# EAGLE design untitled (EAGLE 9.2.2)
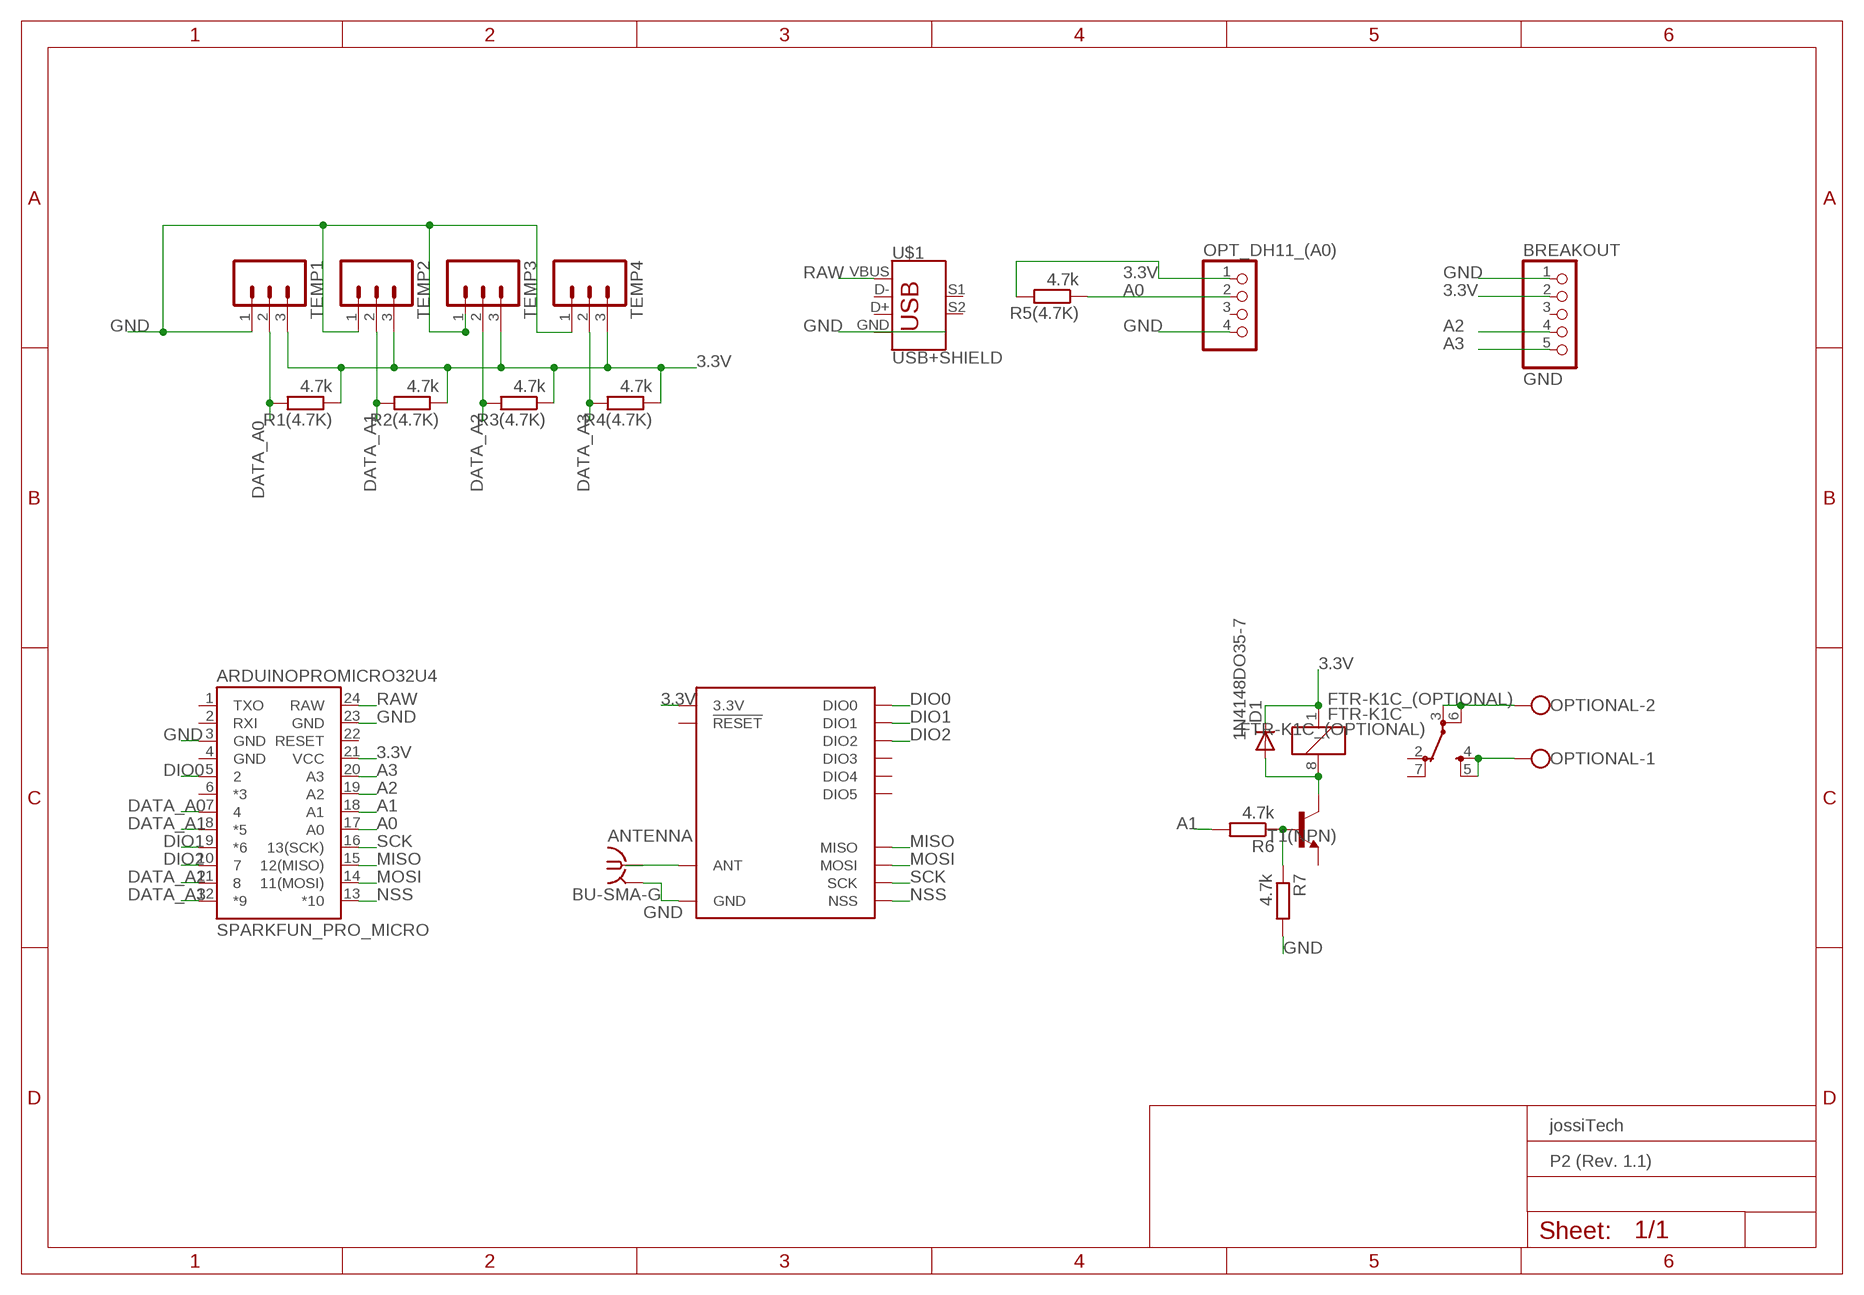
[diagram p0: schematic, sheet 1]
FRAME1 (A4L-LOC): COMPANY: jossiTech; PRODUCT: P2 (Rev. 1.1)

## Parts
ANTENNA  BU-SMA-G  [BU-SMA-G]
ARDUINOPROMICRO32U4  SPARKFUN_PRO_MICRO  [SPARKFUN_PRO_MICRO]
BREAKOUT  GND  PINHD-1X5  [1X05]
D1  1N4148DO35-7  [DO35-7]
FTR-K1C_(OPTIONAL)  FTR-K1C  [FTR-K1C]
OPT_DH11_(A0)  PINHD-1X4  [1X04]
OPTIONAL  W237-102  [W237-102]
R1(4.7K)  4.7k  R0207/10  [0207/10]
R2(4.7K)  4.7k  R0207/10  [0207/10]
R3(4.7K)  4.7k  R0207/10  [0207/10]
R4(4.7K)  4.7k  R0207/10  [0207/10]
R5(4.7K)  4.7k  R0207/10  [0207/10]
R6  4.7k  R0207/10  [0207/10]
R7  4.7k  R0207/10  [0207/10]
T1(NPN)  BC237-NPN-TO92-CBE  [TO92-CBE]
TEMP1  M03  [03P]
TEMP2  M03  [03P]
TEMP3  M03  [03P]
TEMP4  M03  [03P]
U2  RFM95W  [RFM95/96/97/98W]
U$1  USB+SHIELD  [USB-B-PTH]

## Nets
3.3V: ARDUINOPROMICRO32U4.21(VCC) BREAKOUT.2 D1.C FTR-K1C_(OPTIONAL).1 OPT_DH11_(A0).1 R1(4.7K).1 R2(4.7K).1 R3(4.7K).1 R4(4.7K).1 R5(4.7K).2 TEMP1.3 TEMP2.3 TEMP3.3 TEMP4.3 U2.3.3V
A0: ARDUINOPROMICRO32U4.17(A0) OPT_DH11_(A0).2 R5(4.7K).1
A1: ARDUINOPROMICRO32U4.18(A1) R6.2
A2: ARDUINOPROMICRO32U4.19(A2) BREAKOUT.4
A3: ARDUINOPROMICRO32U4.20(A3) BREAKOUT.5
DATA_A0: ARDUINOPROMICRO32U4.7 R1(4.7K).2 TEMP1.2
DATA_A1: ARDUINOPROMICRO32U4.8(*5) R2(4.7K).2 TEMP2.2
DATA_A2: ARDUINOPROMICRO32U4.11 R3(4.7K).2 TEMP3.2
DATA_A3: ARDUINOPROMICRO32U4.12(*9) R4(4.7K).2 TEMP4.2
DIO0: ARDUINOPROMICRO32U4.5 U2.DIO0
DIO1: ARDUINOPROMICRO32U4.9(*6) U2.DIO1
DIO2: ARDUINOPROMICRO32U4.10 U2.DIO2
GND: ANTENNA.2 ANTENNA.3 ANTENNA.4 ANTENNA.5 ARDUINOPROMICRO32U4.3(GND) ARDUINOPROMICRO32U4.23(GND) BREAKOUT.1 OPT_DH11_(A0).4 R7.2 TEMP1.1 TEMP2.1 TEMP3.1 TEMP4.1 U2.GND@1(GND) U2.GND@2(GND) U2.GND@3(GND) U$1.GND
MISO: ARDUINOPROMICRO32U4.15(12(MISO)) U2.MISO
MOSI: ARDUINOPROMICRO32U4.14(11(MOSI)) U2.MOSI
N$1: ANTENNA.1 U2.ANT
N$2: D1.A FTR-K1C_(OPTIONAL).8 T1(NPN).C
N$3: R6.1 R7.1 T1(NPN).B
N$5: FTR-K1C_(OPTIONAL).4(-1:SA) FTR-K1C_(OPTIONAL).5(-1:SB) OPTIONAL.1
N$6: FTR-K1C_(OPTIONAL).3(-1:PA) FTR-K1C_(OPTIONAL).6(-1:PB) OPTIONAL.2
NSS: ARDUINOPROMICRO32U4.13(*10) U2.NSS
RAW: ARDUINOPROMICRO32U4.24(RAW) U$1.VBUS
SCK: ARDUINOPROMICRO32U4.16(13(SCK)) U2.SCK
Unconnected: ARDUINOPROMICRO32U4.1(TXO) ARDUINOPROMICRO32U4.2(RXI) ARDUINOPROMICRO32U4.6(*3) ARDUINOPROMICRO32U4.22(RESET) BREAKOUT.3 FTR-K1C_(OPTIONAL).2(-1:OA) FTR-K1C_(OPTIONAL).7(-1:OB) OPT_DH11_(A0).3 T1(NPN).E U2.!RESET U2.DIO3 U2.DIO4 U2.DIO5 U$1.D+ U$1.D- U$1.S1 U$1.S2

## Power pins joined to a net without a drawn wire
GND: ARDUINOPROMICRO32U4.4(GND)

## Library data of the parts
ANTENNA = con-coax:BU-SMA-G: FEMALE SMA CONNECTOR Radiall distributor RS 193-9117; OC_FARNELL: unknown; OC_NEWARK: unknown
ARDUINOPROMICRO32U4 = SparkFun-Boards:SPARKFUN_PRO_MICRO: SparkFun Pro Micro Atmega32U4 compatible footprint. SparkFun Products: 3.3V/8MHz <https://www.sparkfun.com/products/12587> 5V/16MHz <https://www.sparkfun.com/products/12640>
BREAKOUT = pinhead:PINHD-1X5: PIN HEADER
D1 = diode:1N4148: DIODE high speed (Philips)
FTR-K1C_(OPTIONAL) = relay:FTR-K1C: NETZRELAIS FTR-K1CK024W1XUM 16A/250VAC 1 Umschaltkontakt Distributor: Conrad Electronic Bestell Nr.: 504389-13 - 24V Source: http://www.produktinfo.conrad.com/datenblaetter/500000-524999/504384-da-01-de-NETZRELAIS_FTR_K1CK012W1XUM_16A_250VAC.pdf; OC_FARNELL: unknown; OC_NEWARK: unknown
OPT_DH11_(A0) = pinhead:PINHD-1X4: PIN HEADER
OPTIONAL = con-wago-500:W237-102: WAGO SCREW CLAMP; MPN: 237-102; OC_FARNELL: unknown; OC_NEWARK: 70K9898
R1(4.7K) R2(4.7K) R3(4.7K) R4(4.7K) R5(4.7K) R6 R7 = eagle-ltspice:R: RESISTOR, European symbol; SPICEMODEL: NONE; SPICEPREFIX: R
T1(NPN) = transistor:*-NPN-: NPN Transistror BF959 corrected 2008.03.06
TEMP1-TEMP4 = con-amp-quick:M03: AMP QUICK CONNECTOR; OC_FARNELL: unknown; OC_NEWARK: unknown
U2 = SparkFun-RF:RFM95W: RFM95/96/97/98 The RFM95/96/97/98(W) transceivers feature the LoRaTM long range modem that provides ultra-long range spread spectrum communication and high interference immunity whilst minimising current consumption. These devices also support high performance (G)FSK modes for systems including WMBus, IEEE802.15.4g. The RFM95/96/97/98(W) deliver exceptional phase noise, selectivity, receiver linearity and IIP3 for significantly lower current consumption than competing devices Datasheet <http://www.hoperf.com/upload/rf/RFM95_96_97_98W.pdf>; PROD_ID: IC-13959
U$1 = SparkFun-Retired:USB+SHIELD: USB+Shield USB connector with shield pins connectable

## Board
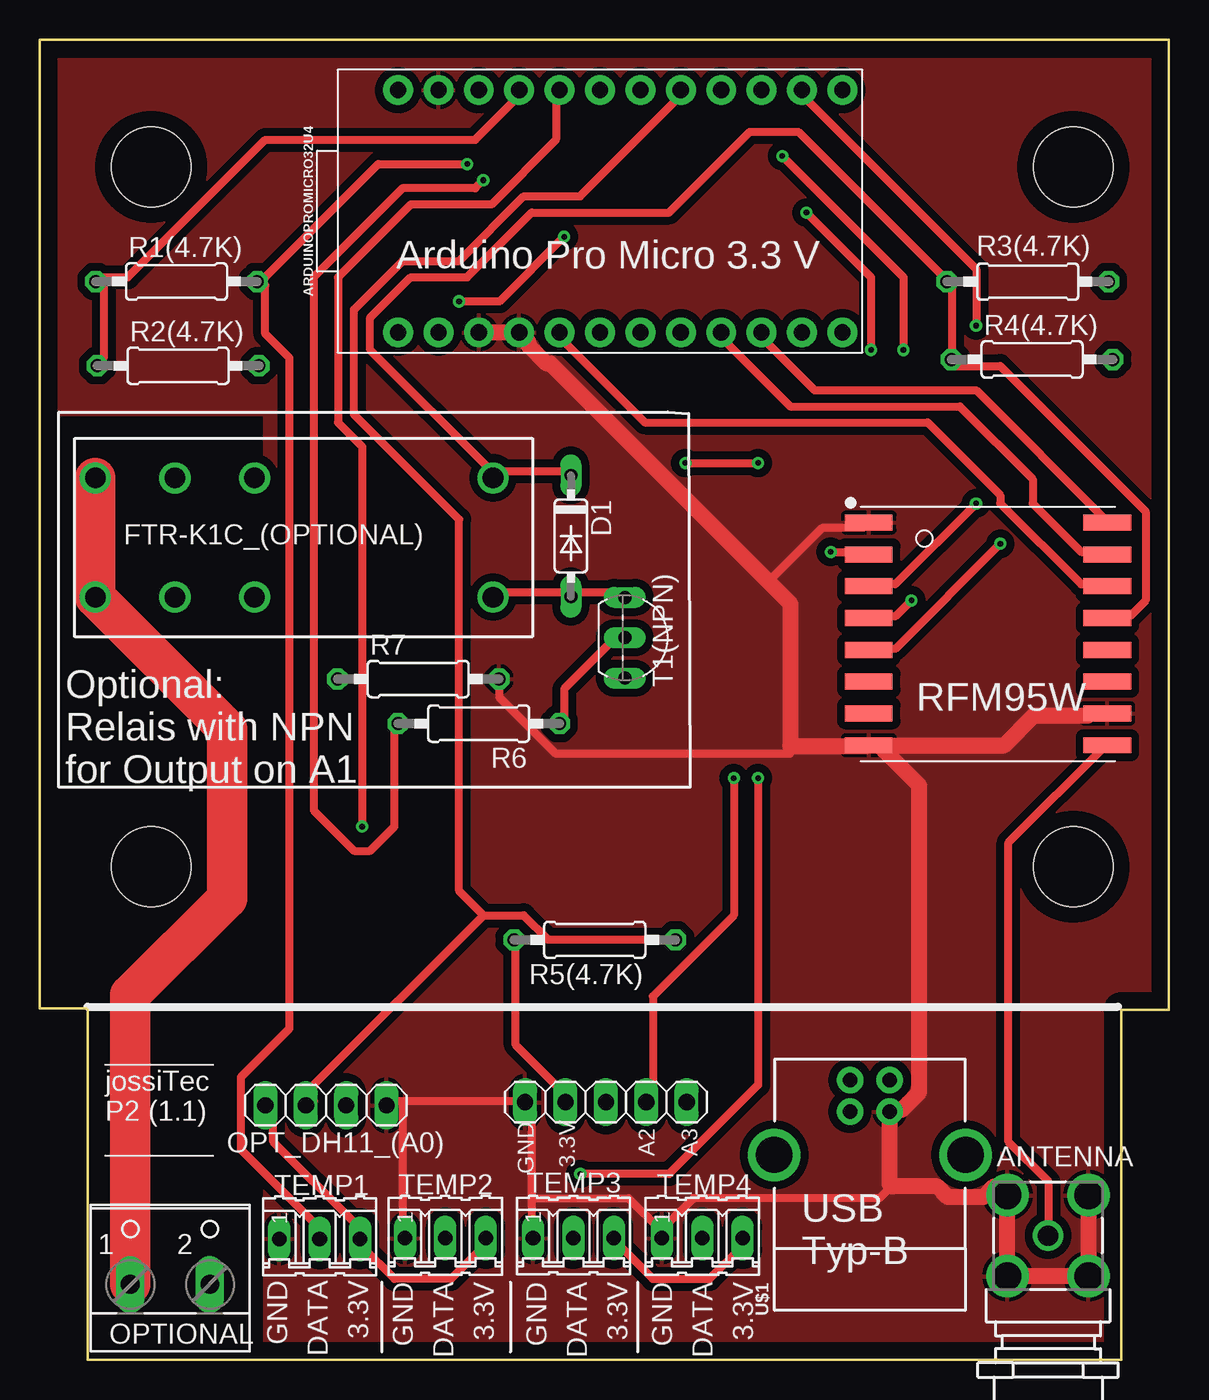
[diagram p1: board, top side]
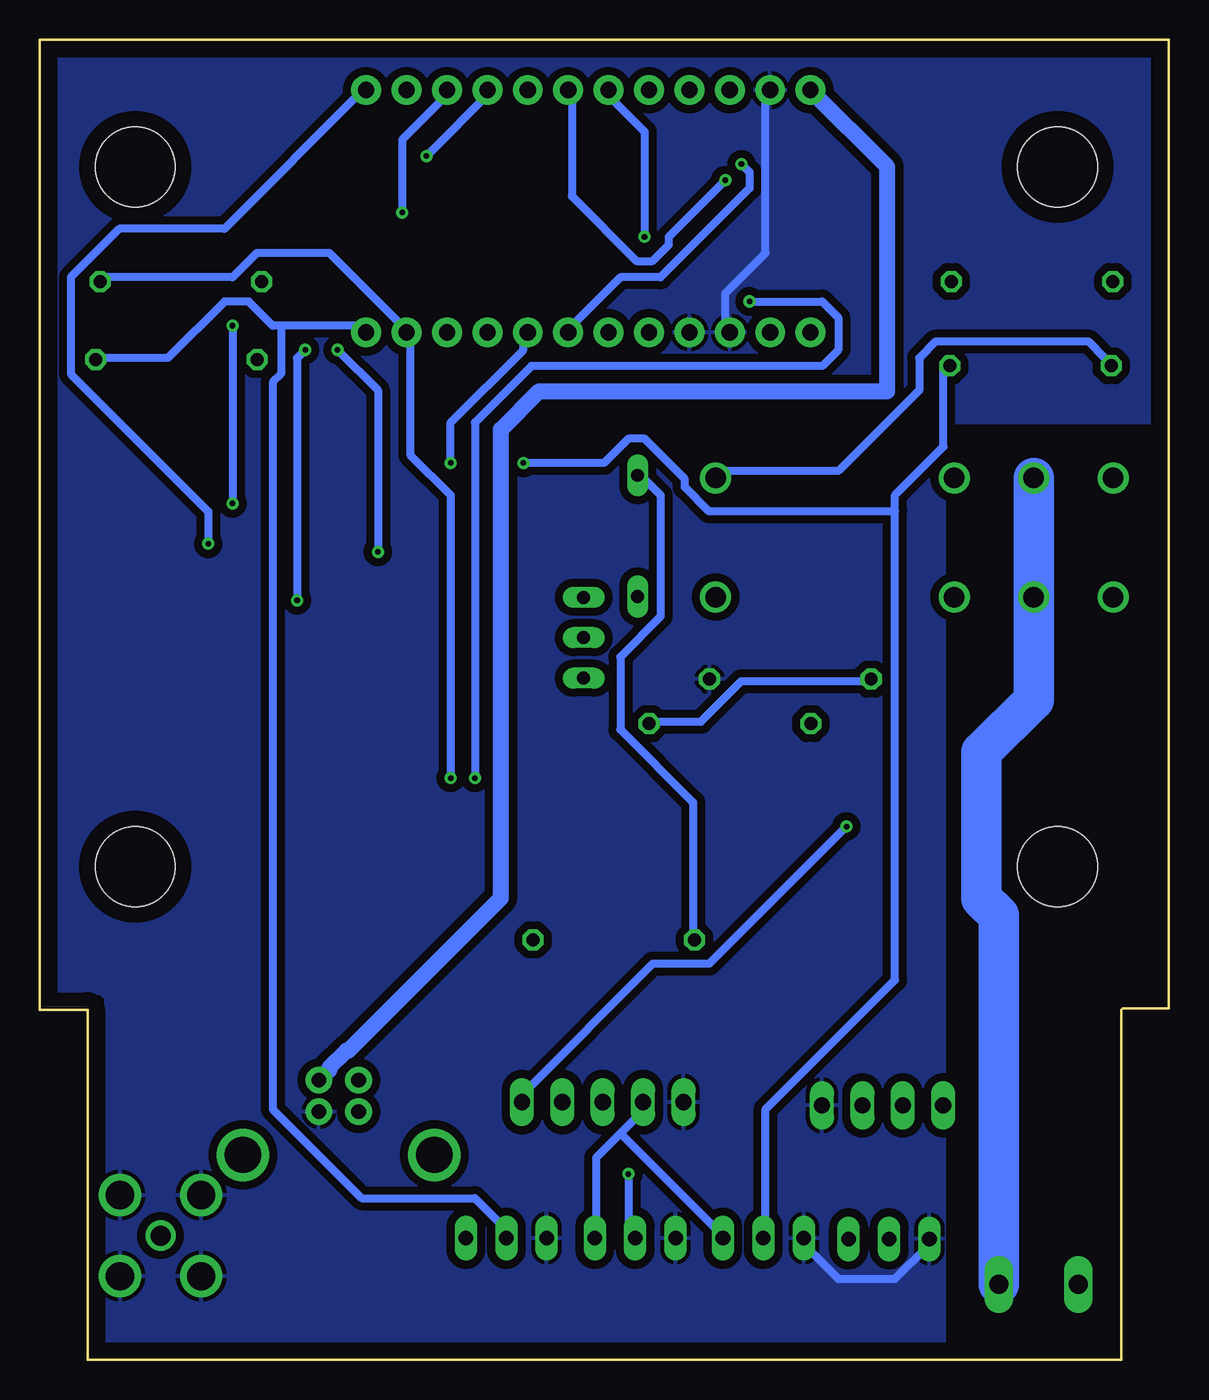
[diagram p2: board, bottom side, seen from below]

Size 71 x 83 mm. Coordinates in mm from the lower left corner, seen from the top.
Outline: 3,0 3,22 2.9,22.1 0,22.1 0,83 71,83 71,22 68,22 68,0 3,0
Copper layers (1*16): Top 0.035mm / dielectric 1.5mm / Bottom 0.035mm
Design rules "default *": minimum track width 20mil, minimum drill 0.35mm, track to track 20mil, track to pad 20mil, pad to pad 20mil, via to via 20mil, smd to smd 20mil, copper to edge 40mil, drill to drill 20mil, minimum pad ring 10mil, minimum via ring 8mil, stop-mask expansion 4mil, vias tented up to drill 0mil, thermal gap 10mil
Holes 5 mm at 7,31 65,31 7,75 65,75
tRestrict: area -2,0.6 to 14,59.3
bRestrict: area -1.2,1.1 to 14,58.8

### Footprints (pad centres in the part's own frame; a part is rotated, then mirrored left to right if it is on the bottom)
BU-SMA-G = drill 1.27: 1 0,0 | drill 1.778: 2 -2.55,2.55; 3 2.55,2.55; 4 2.55,-2.55; 5 -2.55,-2.55
SPARKFUN_PRO_MICRO = drill 1.016 pad 1.88: 1 -7.62,12.7; 2 -7.62,10.16; 3 -7.62,7.62; 4 -7.62,5.08; 5 -7.62,2.54; 6 -7.62,0; 7 -7.62,-2.54; 8 -7.62,-5.08; 9 -7.62,-7.62; 10 -7.62,-10.16; 11 -7.62,-12.7; 12 -7.62,-15.24; 13 7.62,-15.24; 14 7.62,-12.7; 15 7.62,-10.16; 16 7.62,-7.62; 17 7.62,-5.08; 18 7.62,-2.54; 19 7.62,0; 20 7.62,2.54; 21 7.62,5.08; 22 7.62,7.62; 23 7.62,10.16; 24 7.62,12.7
1X05 = drill 1.016 long: 1 -5.08,0; 2 -2.54,0; 3 0,0; 4 2.54,0; 5 5.08,0
DO35-7 = drill 0.813 long: A 3.81,0; C -3.81,0
FTR-K1C = drill 1.3 pad 1.93: 1 -12.5,-3.75; 2 2.5,-3.75; 3 7.5,-3.75; 4 12.5,-3.75; 5 12.5,3.75; 6 7.5,3.75; 7 2.5,3.75; 8 -12.5,3.75
1X04 = drill 1.016 long: 1 -3.81,0; 2 -1.27,0; 3 1.27,0; 4 3.81,0
W237-102 = drill 1.194 long: 1 -2.5,-1.27; 2 2.5,-1.27
0207/10 = drill 0.813 octagon: 1 -5.08,0; 2 5.08,0
TO92-CBE = drill 0.813 long: B 0,0; C -2.54,0; E 2.54,0
03P = drill 0.914 long: 1 -2.54,0; 2 0,0; 3 2.54,0
RFM95/96/97/98W = smd 3 x 1: 3.3V 7.5,1; !RESET -7.5,-3; ANT 7.5,-7; DIO0 7.5,3; DIO1 7.5,5; DIO2 7.5,7; DIO3 7.5,-3; DIO4 7.5,-1; DIO5 -7.5,-5; GND@1 -7.5,7; GND@2 -7.5,-7; GND@3 7.5,-5; MISO -7.5,5; MOSI -7.5,3; NSS -7.5,-1; SCK -7.5,1
USB-B-PTH = drill 0.914 pad 1.676: D+ 0,1.25; D- 1.981,1.25; GND 0,-1.25; VBUS 1.981,-1.25 | drill 2.286: S1 -2.718,-6.02; S2 -2.718,6.02

### Placement (x,y rotation side)
ANTENNA  63.4,7.8 270 top
ARDUINOPROMICRO32U4  35.23,72.22 90 top
BREAKOUT  35.6,16.2 0 top
D1  33.4,51.8 270 top
FTR-K1C_(OPTIONAL)  16,51.7 180 top
OPT_DH11_(A0)  18,16 0 top
OPTIONAL  8.2,6 0 top
R1(4.7K)  8.6,67.8 0 top
R2(4.7K)  8.7,62.5 0 top
R3(4.7K)  62.13,67.79 0 top
R4(4.7K)  62.4,62.9 0 top
R5(4.7K)  34.9,26.4 180 top
R6  27.6,40 180 top
R7  23.8,42.8 0 top
T1(NPN)  36.8,45.4 270 top
TEMP1  17.6,7.6 0 top
TEMP2  25.5,7.64 0 top
TEMP3  33.56,7.65 0 top
TEMP4  41.66,7.64 0 top
U2  59.63,45.64 0 top
U$1  52.2,15.6 90 top

### Tracks (layer width: path | path; a pad name or v marks a point on that pad's centre or on a via)
3.3V
  Top 0.508: TEMP2.3 28.4,7.62 25.86,5.08 22.3,5.08 20.27,7.11 TEMP1.3 19.76,7.62 19.76,8.64 14.68,13.72 14.68,15.75 OPT_DH11_(A0).1 | R5(4.7K).2 29.92,25.91 29.92,19.81 33.48,16.26 BREAKOUT.2 | TEMP4.3 44.15,7.62 44.15,7.11 42.12,5.08 38.56,5.08 36.02,7.62 TEMP3.3 | U2.3.3V 67.52,46.74 68.53,46.74 69.55,47.75 69.55,53.34 60.4,62.48 57.36,62.48 R4(4.7K).1 57.36,62.99 57.36,67.56 R3(4.7K).1 56.85,68.07 47.7,77.22 44.66,77.22 39.58,72.14 30.94,72.14 26.88,68.07 23.32,68.07 20.78,65.53 20.78,63.5 28.4,55.88 FTR-K1C_(OPTIONAL).1 28.91,55.88 32.97,55.88 D1.C | R2(4.7K).1 4.02,62.99 4.02,67.56 R1(4.7K).1 4.02,68.07 5.54,68.07 14.18,76.71 27.38,76.71 29.92,79.25 29.92,79.76 ARDUINOPROMICRO32U4.21
  Bottom 0.508: 34.5,14.22 32.97,15.75 BREAKOUT.2 | 34.5,14.22 36.02,12.7 36.02,8.13 TEMP3.3 | 34.5,14.22 28.4,8.13 TEMP2.3 | FTR-K1C_(OPTIONAL).1 28.4,55.88 20.78,55.88 15.7,60.96 15.7,62.99 14.68,64.01 5.03,64.01 4.02,62.99 R2(4.7K).1 | R5(4.7K).2 29.92,26.42 29.92,35.05 34.5,39.62 34.5,44.2 31.96,46.74 31.96,54.36 32.97,55.37 D1.C
A0
  Top 0.508: 27.89,27.94 30.43,27.94 31.96,26.42 39.58,26.42 R5(4.7K).1 | 27.89,27.94 17.22,17.27 17.22,16.26 OPT_DH11_(A0).2 | 27.89,27.94 26.37,29.46 26.37,52.83 19.76,59.44 19.76,66.04 22.81,69.09 26.37,69.09 30.43,73.15 33.99,73.15 40.08,79.25 40.08,79.76 ARDUINOPROMICRO32U4.17
A1  (via drill 0.35)
  Top 0.508: v27.89,74.17 27.38,73.66 22.81,73.66 17.22,68.07 17.22,34.54 19.76,32 20.78,32 22.3,33.53 22.3,39.62 R6.2
  Bottom 0.508: v27.89,74.17 31.45,70.61 31.45,70.1 32.46,69.09 33.48,69.09 37.54,73.15 37.54,79.76 ARDUINOPROMICRO32U4.18
A2  (via drill 0.35)
  Top 0.508: v43.64,36.58 43.64,27.94 38.56,22.86 38.56,16.26 BREAKOUT.4 | v26.37,66.55 28.91,66.55 v32.97,70.61
  Bottom 0.508: v43.64,36.58 43.64,58.93 40.08,62.48 21.8,62.48 20.78,63.5 20.78,65.53 21.8,66.55 v26.37,66.55 | v32.97,70.61 32.97,77.22 35.51,79.76 ARDUINOPROMICRO32U4.19
A3  (via drill 0.35)
  Top 0.508: v20.27,33.53 20.27,57.4 18.75,58.93 18.75,68.07 23.32,72.64 28.4,72.64 32.46,76.71 32.46,79.76 ARDUINOPROMICRO32U4.20
  Bottom 0.508: v20.27,33.53 28.91,24.89 32.46,24.89 40.59,16.76 40.59,16.26 BREAKOUT.5
DATA_A0  (via drill 0.35)
  Top 0.508: TEMP1.2 17.22,7.62 17.22,8.64 12.65,13.21 12.65,17.78 15.7,20.83 15.7,62.99 14.18,64.52 14.18,67.56 R1(4.7K).2 14.18,68.07 21.29,75.18 v26.88,75.18
  Bottom 0.508: v26.88,75.18 26.37,74.68 26.37,73.66 31.96,68.07 34.5,68.07 37.54,65.02 ARDUINOPROMICRO32U4.7
DATA_A1  (via drill 0.35)
  Top 0.508: v40.59,56.39 v45.16,56.39
  Bottom 0.508: 17.22,53.34 17.22,23.88 25.35,15.75 25.35,8.13 TEMP2.2 | 17.22,53.34 17.22,54.36 14.18,57.4 14.18,62.48 R2(4.7K).2 | v45.16,56.39 45.16,58.93 40.59,63.5 40.59,64.52 ARDUINOPROMICRO32U4.8 | v40.59,56.39 35.51,56.39 33.99,57.91 32.97,57.91 30.43,55.37 30.43,54.86 28.91,53.34 17.22,53.34
DATA_A2  (via drill 0.35)
  Top 0.508: v33.99,11.68 39.58,11.68 45.16,17.27 v45.16,36.58
  Bottom 0.508: R3(4.7K).2 67.01,68.07 58.88,68.07 57.36,69.6 52.78,69.6 48.21,65.02 ARDUINOPROMICRO32U4.11 47.7,64.52 47.7,56.9 45.16,54.36 v45.16,36.58 | v33.99,11.68 33.99,8.13 TEMP3.2
DATA_A3
  Bottom 0.508: 55.83,65.02 50.75,65.02 ARDUINOPROMICRO32U4.12 | 55.83,65.02 56.34,65.02 57.86,66.55 59.39,66.55 62.94,62.99 67.01,62.99 R4(4.7K).2 | 55.83,65.02 55.83,61.98 56.34,61.47 56.34,15.75 50.75,10.16 43.64,10.16 42.12,8.64 42.12,8.13 TEMP4.2
DIO0
  Top 0.508: U2.DIO0 67.01,48.77 65.48,48.77 60.4,53.85 60.4,54.36 55.83,58.93 38.05,58.93 32.46,64.52 ARDUINOPROMICRO32U4.5
DIO1
  Top 0.508: U2.DIO1 67.01,50.8 65.48,50.8 62.44,53.85 62.44,55.37 57.86,59.94 47.2,59.94 42.62,64.52 ARDUINOPROMICRO32U4.9
DIO2
  Top 0.508: U2.DIO2 67.01,52.83 58.88,60.96 48.72,60.96 45.16,64.52 ARDUINOPROMICRO32U4.10
GND
  Top 0.508: 30.94,10.16 30.94,15.75 BREAKOUT.1 30.43,16.26 22.81,16.26 | 30.94,10.16 30.94,8.13 TEMP3.1 | 30.94,10.16 37.04,10.16 39.07,8.13 TEMP4.1 39.58,8.13 39.58,8.64 41.1,10.16 52.78,10.16 53.29,10.67 53.45,11.05 | 22.81,16.26 22.3,16.26 OPT_DH11_(A0).4 | 22.81,16.26 22.81,8.13 TEMP2.1 | R7.2 28.91,42.67 28.91,41.66 32.46,38.1 47.2,38.1 47.2,38.6 | 45.83,48.92 49.23,52.32 51.77,52.32 U2.GND@1 | U2.GND@3 65.99,40.64 65.9,40.5 | 53.1,38.3 53.29,38.61 U2.GND@2
  Top 1.016: ANTENNA.2 ANTENNA.3 ANTENNA.4 ANTENNA.5 60.3,10.9 60.01,10.9 59.33,10.21 57.12,10.21 56.43,10.9 53.6,10.9 53.45,11.05 U$1.GND 53.58,15.73 54.22,15.73 55.3,16.81 55.3,36.1 53.1,38.3 | 65.9,40.5 62.5,40.5 60.64,38.64 U2.GND@2 52.09,38.6 47.2,38.6 47.2,47.55 45.83,48.92 32.11,62.64 31.88,62.64 30.73,63.79 30.73,64.02 ARDUINOPROMICRO32U4.4 ARDUINOPROMICRO32U4.3
  Bottom 0.508: TEMP1.1 15.19,7.11 17.22,5.08 20.78,5.08 23.32,7.62 TEMP2.1 | ARDUINOPROMICRO32U4.23 25.35,79.76 25.35,69.6 27.89,67.06 27.89,65.02 ARDUINOPROMICRO32U4.3
  pour Top: 0.5,82.3 0.5,22.7 3.6,22.7 3.6,1.2 4,0.8 67,0.8 67.6,0.2 67.6,22.5 67.5,22.6 70.3,22.6 70.5,22.8 70.5,82.2 70.2,82.5 0.5,82.5
  pour Bottom: 0.7,82.5 0.7,22.7 3.6,22.7 3.6,0.6 66.9,0.6 66.9,22.7 67.1,22.9 67.2,23 70.5,23 70.5,82.4 70.6,82.5
MISO  (via drill 0.35)
  Top 0.508: v49.74,50.8 51.77,50.8 U2.MISO | v52.28,63.5 52.28,68.07 v48.21,72.14
  Bottom 0.508: v49.74,50.8 49.74,60.96 v52.28,63.5 | v48.21,72.14 48.21,76.71 45.16,79.76 ARDUINOPROMICRO32U4.15
MOSI  (via drill 0.35)
  Top 0.508: v58.88,53.85 53.8,48.77 52.28,48.77 U2.MOSI | v58.88,65.02 58.88,68.58 47.7,79.76 ARDUINOPROMICRO32U4.14
  Bottom 0.508: v58.88,65.02 v58.88,53.85
N$1
  Top 0.508: U2.ANT 67.01,38.61 60.91,32.51 60.91,13.72 63.45,11.18 63.45,8.13 ANTENNA.1
N$2
  Top 0.508: T1(NPN).C 36.53,48.26 33.48,48.26 D1.A 32.97,48.26 28.91,48.26 FTR-K1C_(OPTIONAL).8
N$3
  Top 0.508: R6.1 32.97,40.13 32.97,42.16 36.53,45.72 T1(NPN).B
  Bottom 0.508: R7.1 18.75,42.67 26.88,42.67 29.42,40.13 32.46,40.13 R6.1
N$5
  Top 2.54: OPTIONAL.1 5.7,22.93 11.79,29.02 11.79,39.66 FTR-K1C_(OPTIONAL).5 FTR-K1C_(OPTIONAL).4
N$6
  Bottom 0.508: 8.59,55.37 FTR-K1C_(OPTIONAL).3 | 8.59,48.77 FTR-K1C_(OPTIONAL).6
  Bottom 2.54: OPTIONAL.2 10.7,27.93 11.79,29.02 11.79,38.21 8.5,41.5 FTR-K1C_(OPTIONAL).6 FTR-K1C_(OPTIONAL).3
NSS  (via drill 0.35)
  Top 0.508: v60.4,51.31 53.8,44.7 52.28,44.7 U2.NSS
  Bottom 0.508: v60.4,51.31 60.4,53.34 69.04,61.98 69.04,68.07 65.99,71.12 59.39,71.12 50.75,79.76 ARDUINOPROMICRO32U4.13
RAW
  Bottom 1.016: U$1.VBUS 52.8,18.23 52.8,18.35 51.72,19.43 51.6,19.43 42,29.03 42,58.5 39.6,60.9 17.7,60.9 17.7,75.01 ARDUINOPROMICRO32U4.24
SCK  (via drill 0.35)
  Top 0.508: v54.82,47.75 53.8,46.74 52.28,46.74 U2.SCK | v54.31,63.5 54.31,68.07 v46.69,75.69
  Bottom 0.508: v54.82,47.75 54.82,62.99 v54.31,63.5 | v46.69,75.69 42.62,79.76 ARDUINOPROMICRO32U4.16

### Text on the board
tPlace: Arduino Pro Micro 3.3 V | RFM95W | Optional: / Relais with NPN / for Output on A1 | A2 | A3 | GND | 3.3V | _______ / jossiTec / P2 (1.1) / _______ | USB / Typ-B | GND / DATA / 3.3V | GND / DATA / 3.3V | GND / DATA / 3.3V | GND / DATA / 3.3V